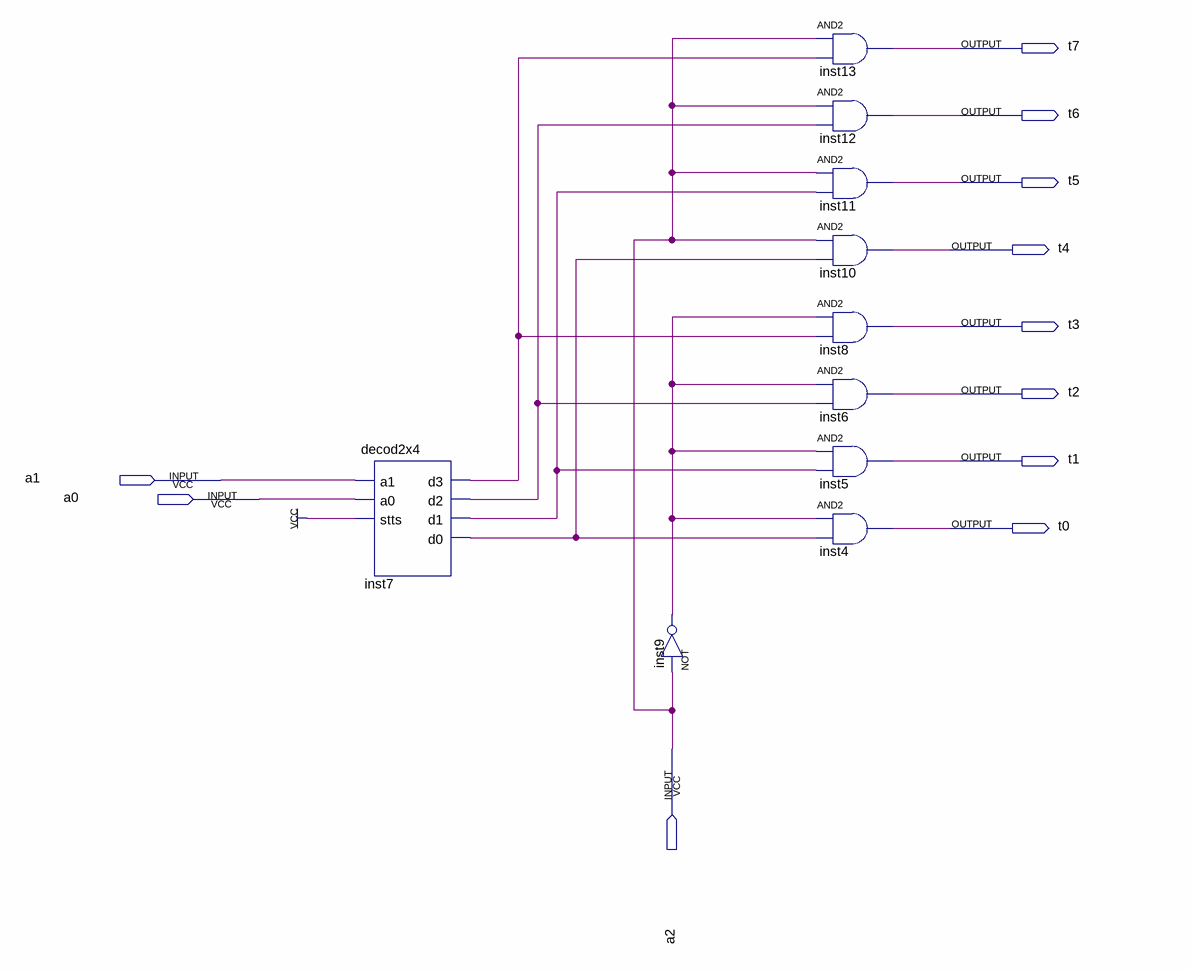
[diagram p0: schematic sheet]
// Quartus schematic decod3x8.bdf as structural Verilog: 10 symbols, 11 pins
module decod3x8 (
  input  a1,
  input  a0,
  input  a2,
  output t7,
  output t6,
  output t5,
  output t4,
  output t3,
  output t2,
  output t1,
  output t0
);

  wire inst7_d0, inst7_d1, inst7_d2, inst7_d3, inst9_out;

  decod2x4 inst7 (.a1(a1), .a0(a0), .stts(1'b1), .d3(inst7_d3), .d2(inst7_d2), .d1(inst7_d1), .d0(inst7_d0));
  not inst9 (inst9_out, a2);
  and inst13 (t7, a2, inst7_d3);
  and inst12 (t6, a2, inst7_d2);
  and inst11 (t5, a2, inst7_d1);
  and inst10 (t4, a2, inst7_d0);
  and inst8 (t3, inst9_out, inst7_d3);
  and inst6 (t2, inst9_out, inst7_d2);
  and inst5 (t1, inst9_out, inst7_d1);
  and inst4 (t0, inst9_out, inst7_d0);
endmodule
